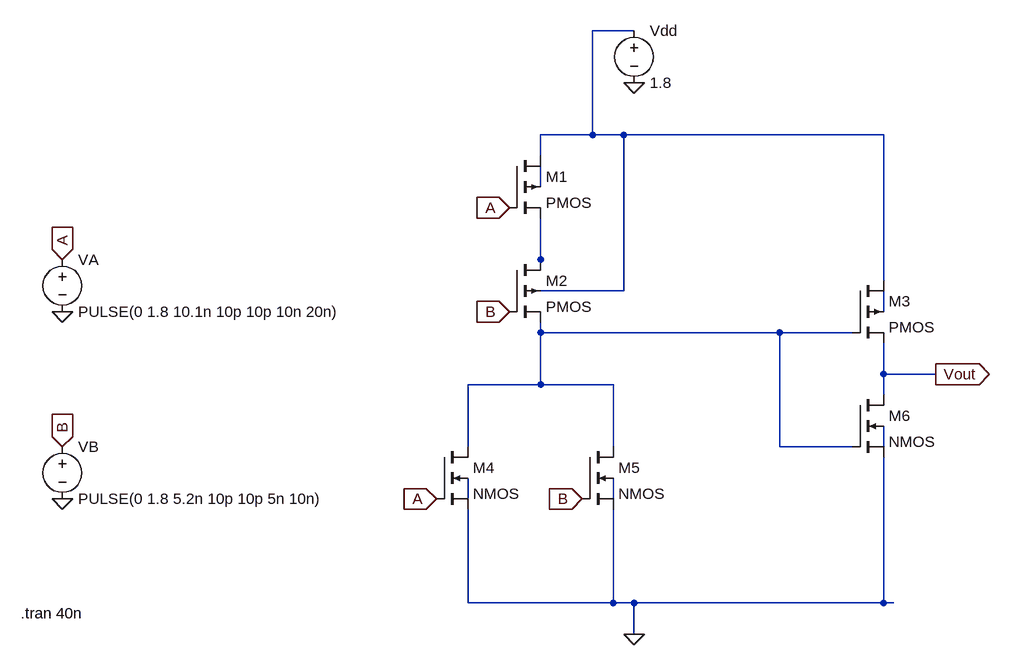
[diagram p0: schematic OR.asc]
OR.asc, the LTspice schematic file:
Version 4.1
SHEET 1 880 820
WIRE 288 -128 224 -128
WIRE 224 32 224 -128
WIRE 224 32 144 32
WIRE 272 32 224 32
WIRE 672 32 272 32
WIRE 144 64 144 32
WIRE 144 112 144 80
WIRE 144 224 144 160
WIRE 144 240 144 224
WIRE 672 256 672 32
WIRE 272 272 272 32
WIRE 272 272 144 272
WIRE 672 304 672 272
WIRE 144 336 144 320
WIRE 512 336 144 336
WIRE 624 336 512 336
WIRE 672 400 672 352
WIRE 752 400 672 400
WIRE 144 416 144 336
WIRE 144 416 32 416
WIRE 256 416 144 416
WIRE 672 432 672 400
WIRE 32 512 32 416
WIRE 256 512 256 416
WIRE 512 512 512 336
WIRE 624 512 512 512
WIRE 672 512 672 480
WIRE 32 592 32 560
WIRE 256 592 256 560
WIRE 32 752 32 608
WIRE 256 752 256 608
WIRE 256 752 32 752
WIRE 288 752 256 752
WIRE 672 752 672 528
WIRE 672 752 288 752
WIRE 688 752 672 752
WIRE 288 800 288 752
FLAG 96 144 A
IOPIN 96 144 In
FLAG -16 592 A
IOPIN -16 592 In
FLAG 96 304 B
IOPIN 96 304 In
FLAG 208 592 B
IOPIN 208 592 In
FLAG 288 -48 0
FLAG 752 400 Vout
IOPIN 752 400 Out
FLAG -592 224 A
IOPIN -592 224 In
FLAG -592 512 B
IOPIN -592 512 In
FLAG -592 304 0
FLAG -592 592 0
FLAG 288 800 0
SYMBOL pmos4 96 64 R0
SYMATTR InstName M1
SYMATTR Value2 l=180n w=1600n
SYMBOL pmos4 96 224 R0
SYMATTR InstName M2
SYMATTR Value2 l=180n w=1600n
SYMBOL pmos4 624 256 R0
SYMATTR InstName M3
SYMATTR Value2 l=180n w=800n
SYMBOL nmos4 -16 512 R0
SYMATTR InstName M4
SYMATTR Value2 l=180n w=400n
SYMBOL nmos4 208 512 R0
SYMATTR InstName M5
SYMATTR Value2 l=180n w=400n
SYMBOL nmos4 624 432 R0
SYMATTR InstName M6
SYMATTR Value2 l=180n w=400n
SYMBOL voltage 288 -144 R0
WINDOW 123 0 0 Left 0
WINDOW 39 0 0 Left 0
SYMATTR InstName Vdd
SYMATTR Value 1.8
SYMBOL voltage -592 208 R0
WINDOW 123 0 0 Left 0
WINDOW 39 0 0 Left 0
SYMATTR InstName VA
SYMATTR Value PULSE(0 1.8 10.1n 10p 10p 10n 20n)
SYMBOL voltage -592 496 R0
WINDOW 123 0 0 Left 0
WINDOW 39 0 0 Left 0
SYMATTR InstName VB
SYMATTR Value PULSE(0 1.8 5.2n 10p 10p 5n 10n)
TEXT -656 768 Left 2 !.tran 40n

The netlist it stands for:
* OR.asc
M1 N001 A N003 N002 PMOS l=180n w=1600n
M2 N003 B N005 N001 PMOS l=180n w=1600n
M3 N001 N005 Vout N004 PMOS l=180n w=800n
M4 N005 A 0 N007 NMOS l=180n w=400n
M5 N005 B 0 N008 NMOS l=180n w=400n
M6 Vout N005 0 N006 NMOS l=180n w=400n
Vdd N001 0 1.8
VA A 0 PULSE(0 1.8 10.1n 10p 10p 10n 20n)
VB B 0 PULSE(0 1.8 5.2n 10p 10p 5n 10n)
.model NMOS NMOS
.model PMOS PMOS
.lib standard.mos
.tran 40n
.backanno
.end